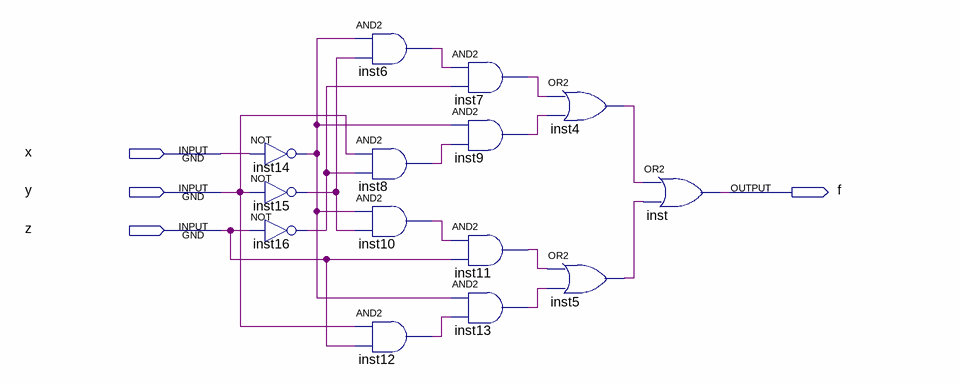
[diagram p0: schematic sheet]
// Quartus schematic 1-3-before.bdf as structural Verilog: 14 symbols, 4 pins
module \1-3-before  (
  input  x,
  input  y,
  input  z,
  output f
);

  wire inst4_out, inst5_out, inst6_out, inst7_out, inst8_out, inst9_out, inst10_out, inst11_out, inst12_out,
       inst13_out, inst14_out, inst15_out, inst16_out;

  not inst14 (inst14_out, x);
  not inst15 (inst15_out, y);
  not inst16 (inst16_out, z);
  and inst6 (inst6_out, inst14_out, inst15_out);
  and inst8 (inst8_out, y, inst16_out);
  and inst10 (inst10_out, inst14_out, inst15_out);
  and inst12 (inst12_out, y, z);
  and inst7 (inst7_out, inst6_out, inst16_out);
  and inst9 (inst9_out, inst14_out, inst8_out);
  and inst11 (inst11_out, inst10_out, z);
  and inst13 (inst13_out, inst14_out, inst12_out);
  or inst4 (inst4_out, inst7_out, inst9_out);
  or inst5 (inst5_out, inst11_out, inst13_out);
  or inst (f, inst4_out, inst5_out);
endmodule
